# EasyEDA schematic Sheet_1.json
TITLE: Sheet_1; REV: 1.0; Date: 2024-08-08; Sheet: 1/1; Drawn By: k754a; Company: Your Company
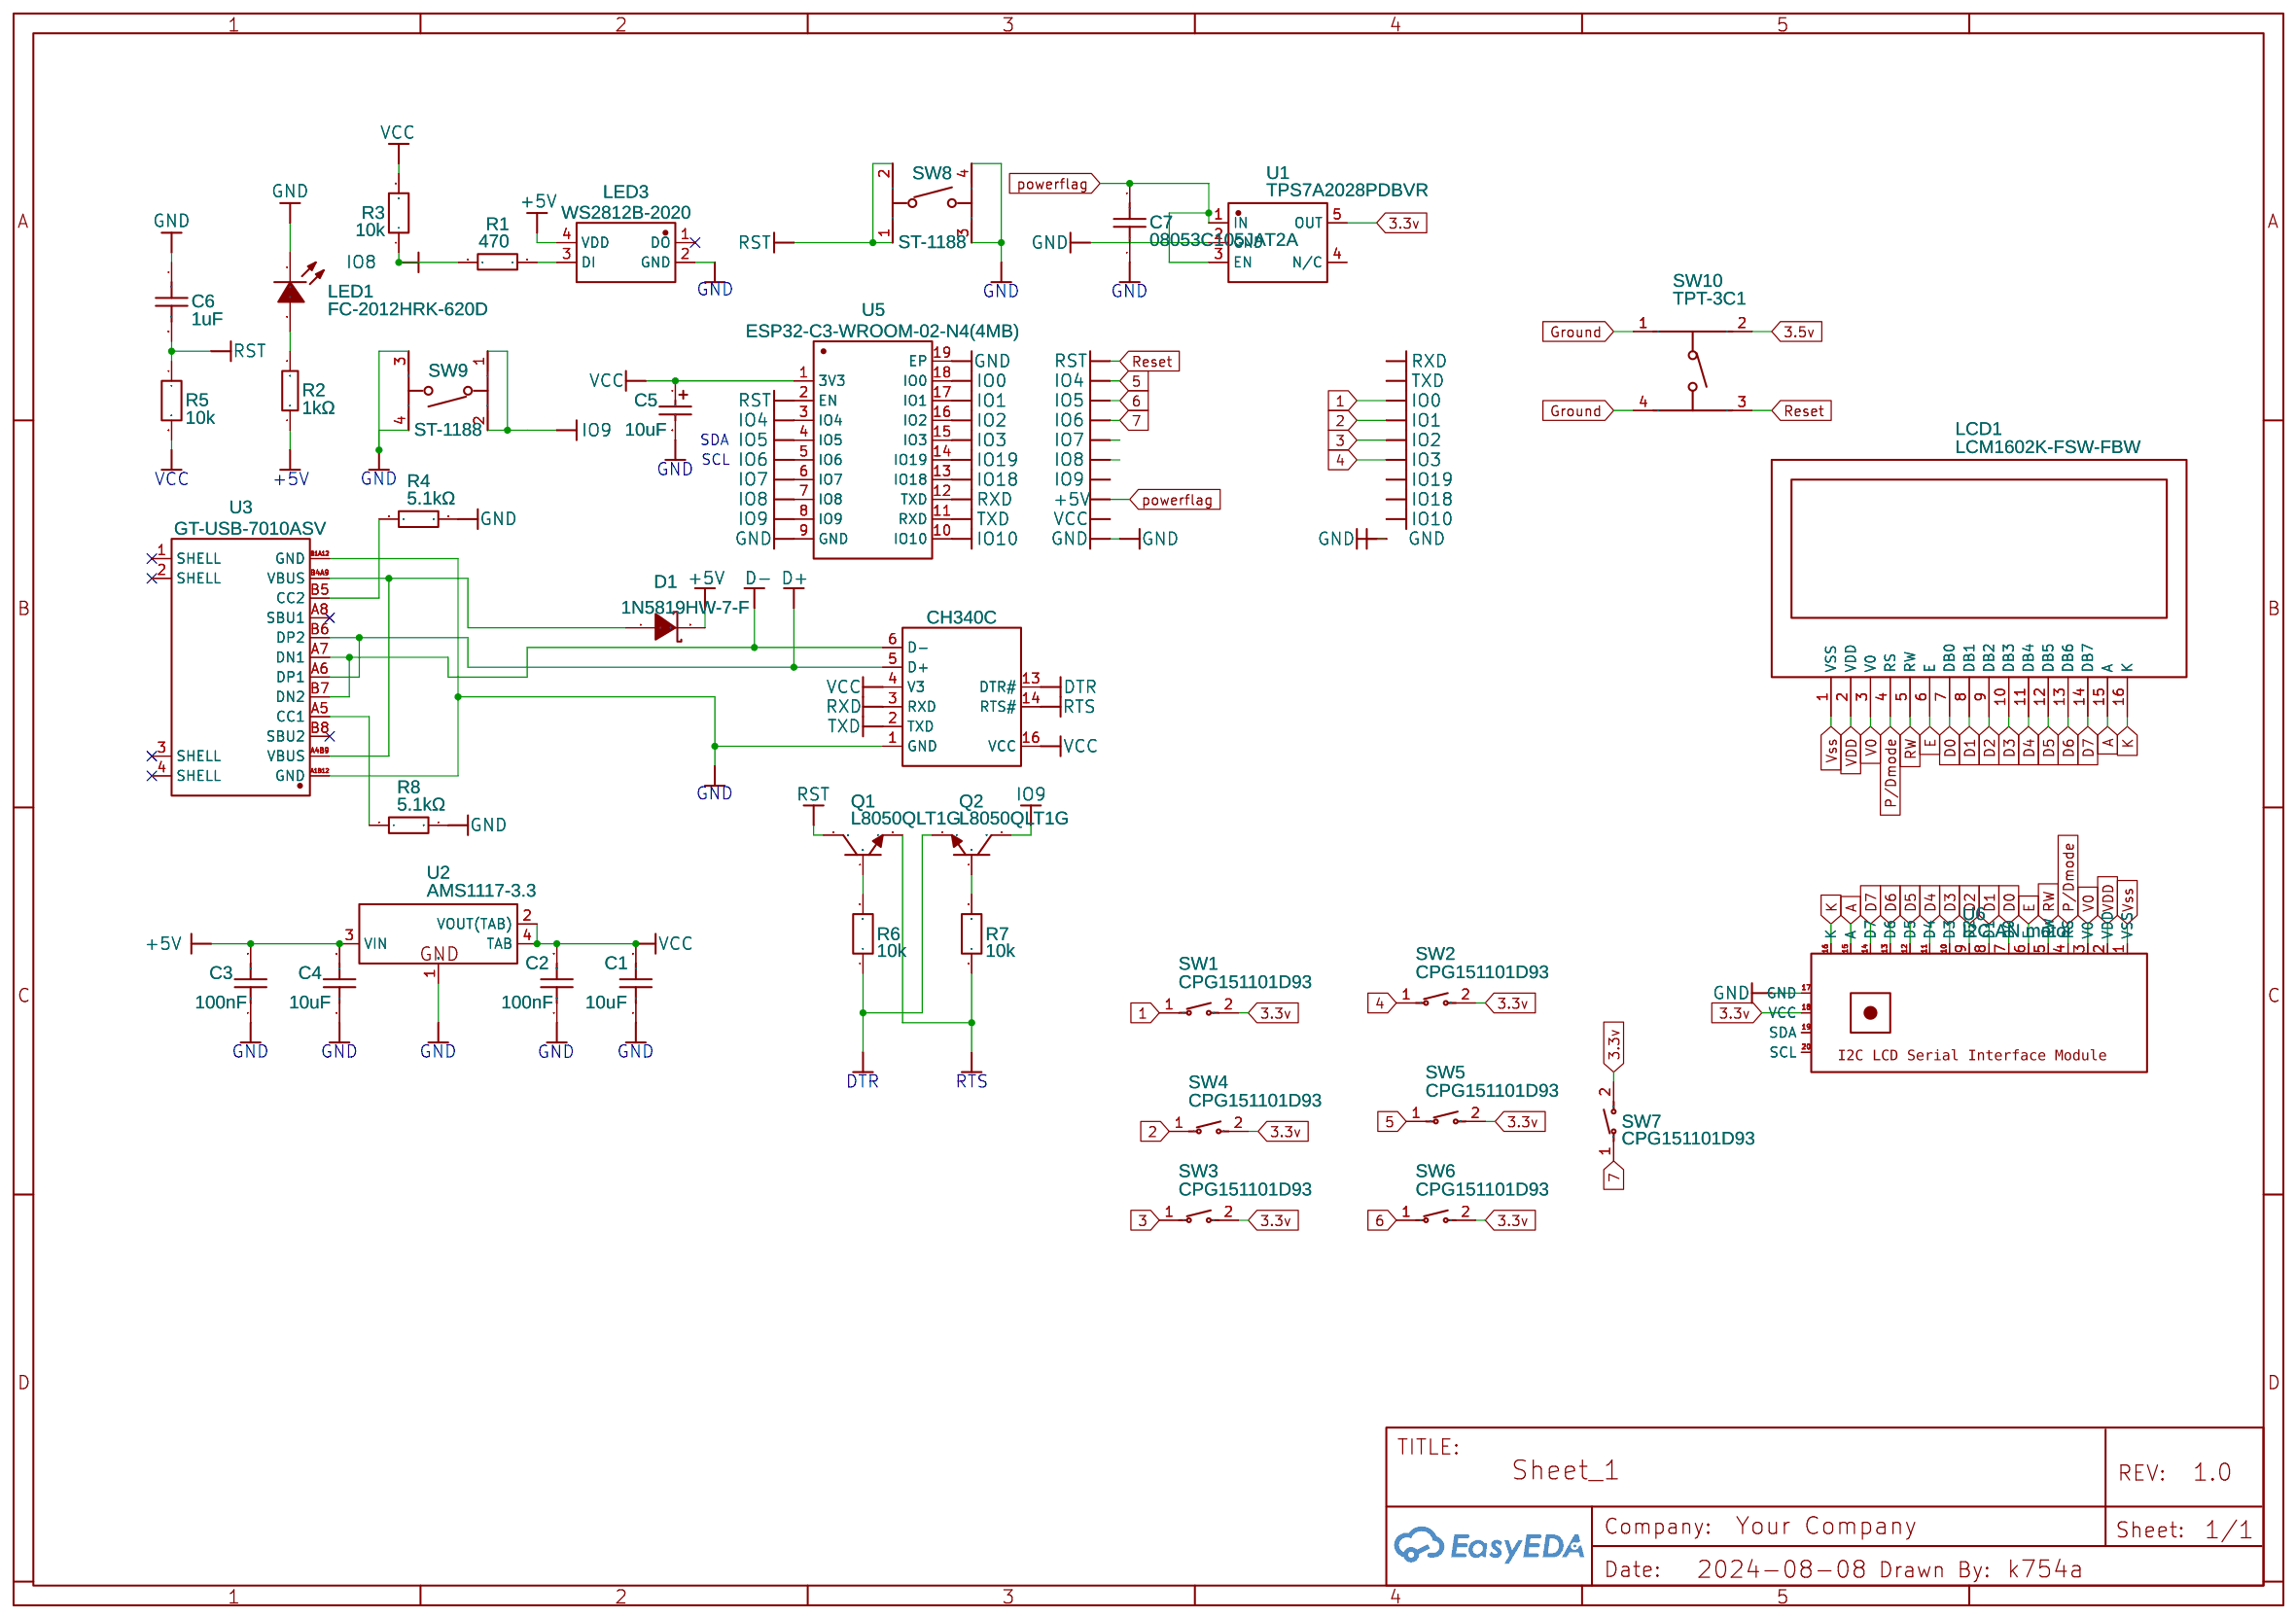
[diagram p0: schematic sheet]

## Parts
C1  10uF  [C0805]
C2  100nF  [C0805]
C3  100nF  [C0805]
C4  10uF  [C0805]
C5  10uF  [CASE-B_3528]
C6  1uF  [C0805]
C7  08053C105JAT2A  [C 0805]
D1  1N5819HW-7-F  [SOD-123_L2.8-W1.8-LS3.7-FD]
LCD1  LCM1602K-FSW-FBW  [MODULE-TH_LCM1602K]
LED1  FC-2012HRK-620D  [LED0805-RD]
LED3  WS2812B-2020  [LED-SMD_4P-L2.0-W2.0-TL_WS2812B-2020]
Q1  L8050QLT1G  [SOT-23-3_L2.9-W1.3-P1.90-LS2.4-BR]
Q2  L8050QLT1G  [SOT-23-3_L2.9-W1.3-P1.90-LS2.4-BR]
R1  470  [R0805]
R2  1kΩ  [R0805]
R3  10k  [R0805]
R4  5.1kΩ  [R0603]
R5  10k  [R0805]
R6  10k  [R0805]
R7  10k  [R0805]
R8  5.1kΩ  [R0603]
SW1  CPG151101D93  [SW-TH_CPG151101D9X]
SW2  CPG151101D93  [SW-TH_CPG151101D9X]
SW3  CPG151101D93  [SW-TH_CPG151101D9X]
SW4  CPG151101D93  [SW-TH_CPG151101D9X]
SW5  CPG151101D93  [SW-TH_CPG151101D9X]
SW6  CPG151101D93  [SW-TH_CPG151101D9X]
SW7  CPG151101D93  [SW-TH_CPG151101D9X]
SW8  ST-1188  [SW-SMD_4P-L4.2-W3.2-P2.15-LS5.2]
SW9  ST-1188  [SW-SMD_4P-L4.2-W3.2-P2.15-LS5.2]
SW10  TPT-3C1  [KEY-SMD_4P-L2.8-W1.9-P1.16]
U1  TPS7A2028PDBVR  [SOT-23-5_L2.9-W1.6-P0.95-LS2.8-BR]
U2  AMS1117-3.3  [SOT-223_L6.7-W3.5-P2.30-BR]
U3  GT-USB-7010ASV  [USB-C-7010ASV]
U4  CH340C  [CH340C]
U5  ESP32-C3-WROOM-02-N4(4MB)  [BULETM-SMD_ESPRESSIF_ESP32-C3-WROOM-02-N4-4MB]
U6  I2C AN motor  [TRKTRONICS FOOTPRINT - I2C LCD SERIAL INTERFACE MODULE]

## Library data of the parts
C1 C4 = 0805X106M250NT: Supplier: LCSC; Supplier Part: C669099; Manufacturer: FH(风华); Contributor: LCSC; JLCPCB Part Class: Extended Part
C2 C3 = C0603C104J3RACAUTO: Supplier: LCSC; Supplier Part: C141079; Manufacturer: KEMET; Contributor: LCSC; JLCPCB Part Class: Extended Part
C5 = TAJB106K016RNJ: Supplier: LCSC; Manufacturer: Kyocera AVX; Supplier Part: C7193; JLCPCB Part Class: Extended Part
C6 = C_0603_US: Supplier Part: C28323; Supplier: LCSC; Contributor: LCEDA_Lib; Manufacturer Part: CL21B105KBFNNNE; Manufacturer: SAMSUNG
C7 = 08053C105JAT2A: Manufacturer: KYOCERA AVX; Supplier: Digi-Key; Supplier Part: 478-10487-1-ND; link: https://www.digikey.ca/en/products/detail/kyocera-avx/08053C105JAT2A/1602174; Contributor: optechalexd
D1 = 1N5819HW-7-F: Supplier: LCSC; Manufacturer: DIODES; Supplier Part: C82544; JLCPCB Part Class: Extended Part
LCD1 = LCM1602K-FSW-FBW: Supplier: LCSC; Manufacturer: LONTECH(厦门龙特); Supplier Part: C83274; JLCPCB Part Class: Extended Part
LED1 = FC-2012HRK-620D: Supplier: LCSC; Manufacturer: 国星光电; Manufacturer Part: NCD0805R1; Supplier Part: C84256; JLCPCB Part Class: Basic Part
LED3 = WS2812B-2020: Supplier: LCSC; Supplier Part: C965555; Manufacturer: worldsemi; Contributor: LCSC; JLCPCB Part Class: Extended Part
Q1 Q2 = L8050QLT1G: Supplier: LCSC; Manufacturer: LRC; Supplier Part: C49581; JLCPCB Part Class: Extended Part
R1 = RMC08054701%N: Supplier: LCSC; Supplier Part: C269542; Manufacturer: Tyohm; Contributor: LCSC; JLCPCB Part Class: Extended Part
R2 = 0805W8F1001T5E: Supplier: LCSC; Manufacturer: UNI-ROYAL(厚声); Supplier Part: C17513; Resistance (Ohms): 1K; JLCPCB Part Class: Basic Part
R3 R5-R7 = R_0603_EU: Supplier Part: C117695; Supplier: LCSC; Contributor: LCEDA_Lib; Manufacturer Part: B57221V2103J060; Manufacturer: TDK
R4 R8 = RTT03512JTP: Supplier: LCSC; Manufacturer: RALEC(旺诠); Supplier Part: C103696; Resistance (Ohms): 5.1K; JLCPCB Part Class: Extended Part
SW1-SW7 = CPG151101D93: Contributor: LCSC; Supplier: LCSC; Supplier Part: C400237; Manufacturer: Kailh(凯华); JLCPCB Part Class: Extended Part
SW8 SW9 = ST-1188: Supplier: LCSC; Supplier Part: C589212; Manufacturer: RI SHENG; Contributor: LCSC; JLCPCB Part Class: Extended Part
SW10 = TPT-3C1: Contributor: LCSC; Supplier: LCSC; Supplier Part: C2830195; Manufacturer: ROCPU Switches(台普); JLCPCB Part Class: Extended Part
U1 = TPS7A2028PDBVR: Contributor: lcsc; Supplier: LCSC; Supplier Part: C2869847; Manufacturer: TI(德州仪器); JLCPCB Part Class: Extended Part
U2 = AMS1117-3.3: Supplier: LCSC; Supplier Part: C347222; Manufacturer: Youtai Semiconductor Co., Ltd.; Contributor: Fangbrbr; SMT Type: Extend; JLCPCB SMD: Yes
U3 = GT-USB-7010ASV: Supplier: LCSC; Supplier Part: C2988369; Manufacturer: G-Switch(品赞); link: https://atta.szlcsc.com/upload/public/pdf/source/20220407/276C2E8CEADC75D1A3BE3EA4074DCCE5.pdf; Contributor: lcsc; JLCPCB Part Class: Extended Part
U4 = CH340C: Supplier: LCSC; Manufacturer: WCH; Supplier Part: C84681; Paste Type: recommend; Contributor: Fangbrbr; Package Display: No
U5 = ESP32-C3-WROOM-02-N4(4MB): Supplier: LCSC; Supplier Part: C2934560; Manufacturer: ESPRESSIF 乐鑫; Contributor: LCSC
U6 = I2C AN motor: Supplier: Mouser; Contributor: an_motor

## Nets
3.3v: SW1.2 SW2.2 SW3.2 SW4.2 SW5.2 SW6.2 SW7.2 U1.5(OUT)
3.5v: SW10.2
+5V: C3.2 C4.2 C7.2 D1.2(K) LED3.4(VDD) R2.1 U1.1(IN) U1.3(EN) U2.3(VIN)
GND: C1.1 C2.1 C3.1 C4.1 C5.2 C6.1 C7.1 LED1.1(-) LED3.2(GND) R4.2 R8.2 SW8.3 SW8.4 SW9.3 SW9.4 U1.2(GND) U2.1(ADJ(GND)) U3.A1B12(GND) U3.B1A12(GND) U4.1(GND) U5.9(GND) U5.19(EP)
V0: LCD1.3(V0)
VCC: C1.2 C2.2 C5.1 R3.2 R5.2 U2.2(VOUT(TAB)) U2.4(TAB) U4.4(V3) U4.16(VCC) U5.1(3V3)
VDD: LCD1.2(VDD)
Vss: LCD1.1(VSS)
1: SW1.1 U5.18(IO0)
2: SW4.1 U5.17(IO1)
3: SW3.1 U5.16(IO2)
4: SW2.1 U5.15(IO3)
5: SW5.1 U5.3(IO4)
6: SW6.1 U5.4(IO5)
7: SW7.1 U5.5(IO6)
A: LCD1.15(A)
D0: LCD1.7(DB0)
D1: LCD1.8(DB1)
D2: LCD1.9(DB2)
D3: LCD1.10(DB3)
D4: LCD1.11(DB4)
D5: LCD1.12(DB5)
D6: LCD1.13(DB6)
D7: LCD1.14(DB7)
D+: U3.A6(DP1) U3.B6(DP2) U4.5(D+)
D-: U3.A7(DN1) U3.B7(DN2) U4.6(D-)
DTR: Q2.2(E) R6.1 U4.13(DTR#)
E: LCD1.6(E)
Ground: SW10.1 SW10.4
IO7: U5.6(IO7)
IO8: R1.2 R3.1 U5.7(IO8)
IO9: Q2.3(C) SW9.1 SW9.2 U5.8(IO9)
IO10: U5.10(IO10)
IO18: U5.13(IO18)
IO19: U5.14(IO19)
K: LCD1.16(K)
P/Dmode: LCD1.4(RS)
RST: C6.2 Q1.3(C) R5.1 SW8.1 SW8.2 SW10.3 U5.2(EN)
RTS: Q1.2(E) R7.1 U4.14(RTS#)
RW: LCD1.5(RW)
RXD: U4.3(RXD) U5.12(TXD)
TXD: U4.2(TXD) U5.11(RXD)
Net-(D1-1): D1.1(A) U3.A4B9(VBUS) U3.B4A9(VBUS)
Net-(LED1-2): LED1.2(+) R2.2
Net-(LED3-3): LED3.3(DI) R1.1
Net-(Q1-1): Q1.1(B) R6.2
Net-(Q2-1): Q2.1(B) R7.2
Net-(R4-1): R4.1 U3.B5(CC2)
Net-(R8-1): R8.1 U3.A5(CC1)

Not connected (* = marked no-connect by the designer): LED3 1(DO)*; U1 4(N/C); U3 1(SHELL)* 2(SHELL)* 3(SHELL)* 4(SHELL)* A8(SBU1)* B8(SBU2)*; U6 1(VSS) 2(VDD) 3(V0) 4(RS) 5(RW) 6(E) 7(D0) 8(D1) 9(D2) 10(D3) 11(D4) 12(D5) 13(D6) 14(D7) 15(A) 16(K) 17(GND) 18(VCC) 19(SDA) 20(SCL)

## Notes on the sheet
- SDA
- SCL
